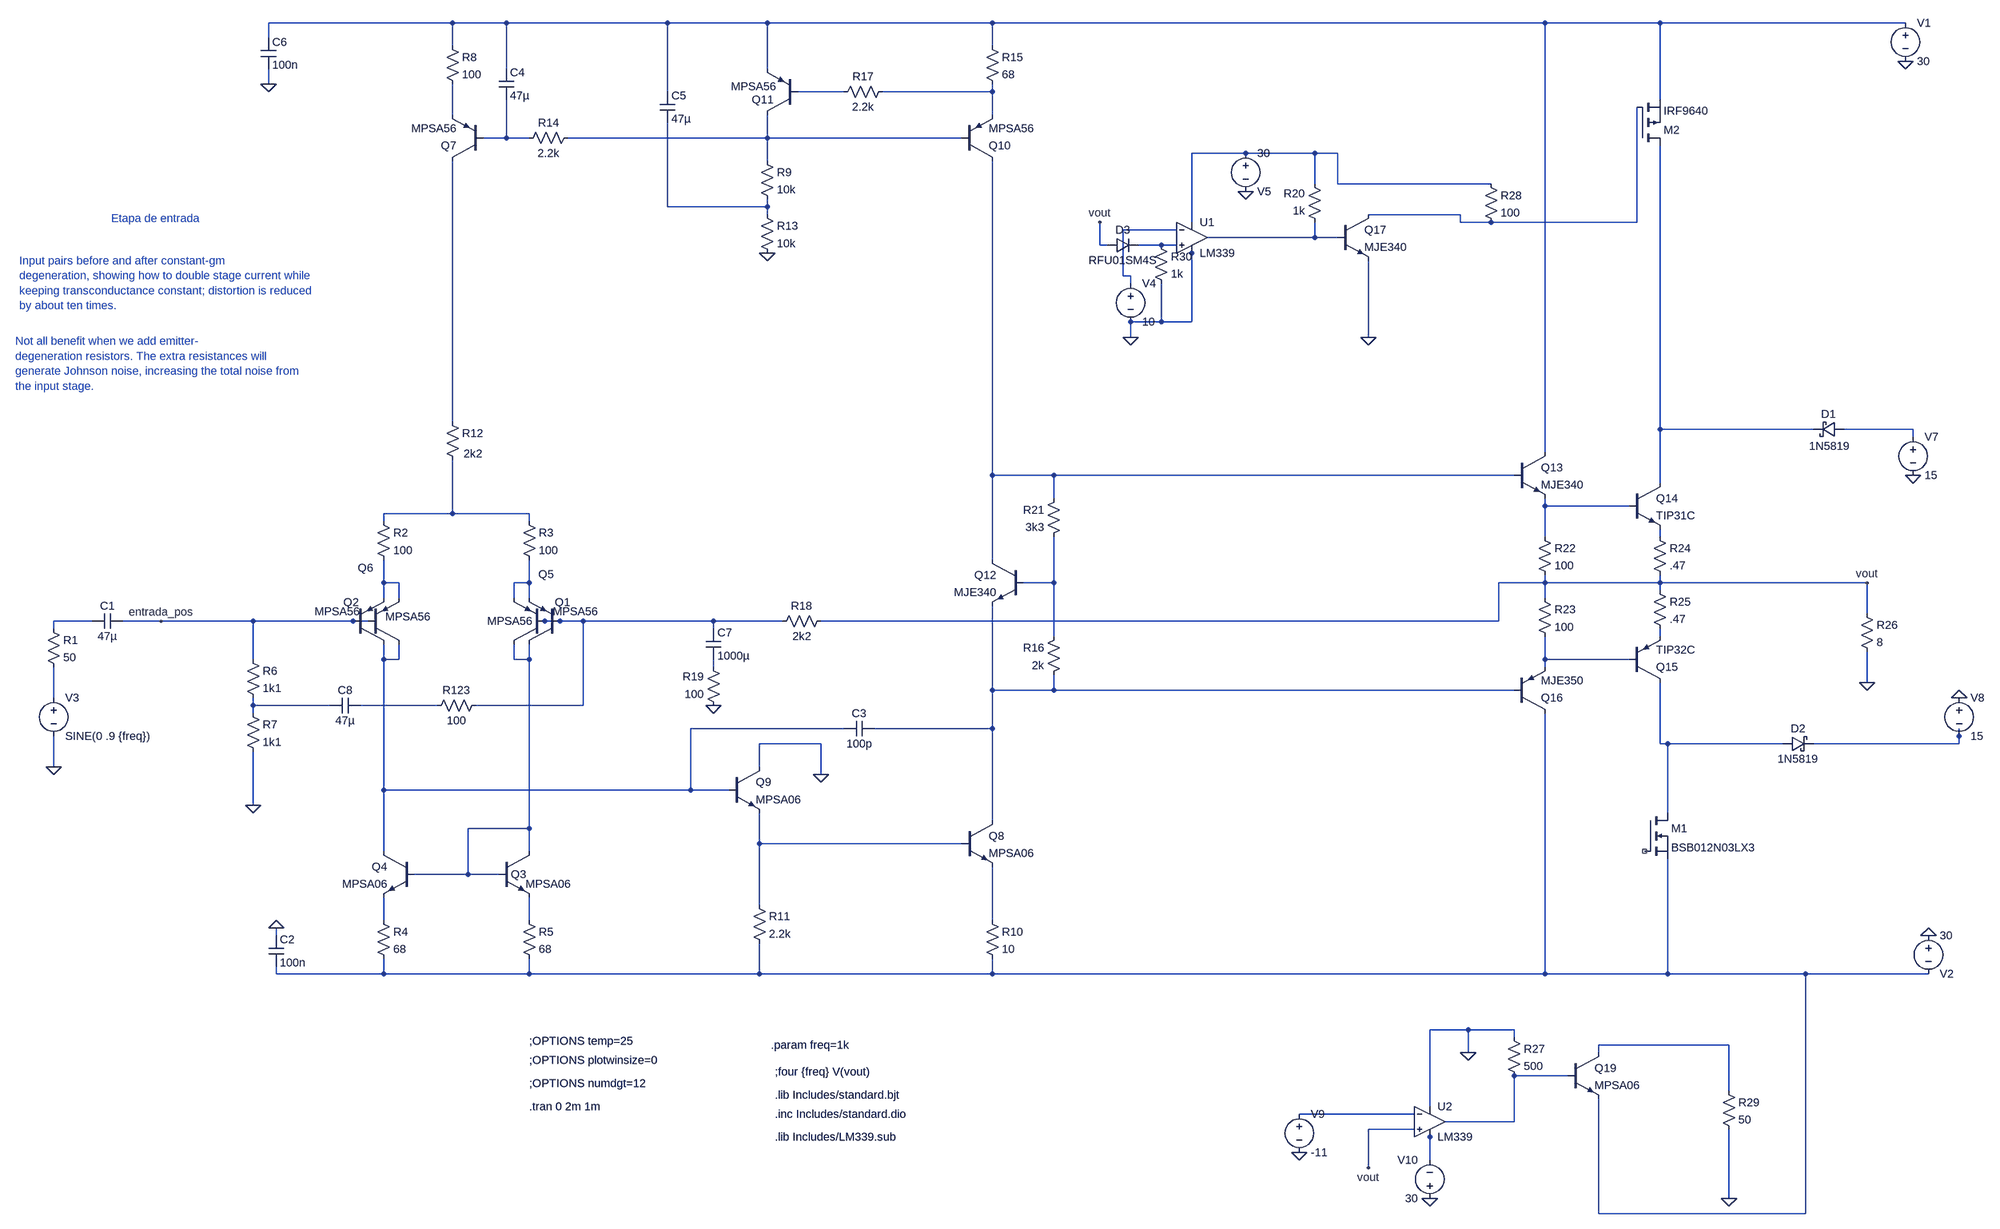
[diagram p0: schematic douglasSape.asc]
douglasSape.asc, the LTspice schematic file:
Version 4
SHEET 1 4788 1544
WIRE 480 -1824 96 -1824
WIRE 592 -1824 480 -1824
WIRE 928 -1824 592 -1824
WIRE 1136 -1824 928 -1824
WIRE 1664 -1824 1136 -1824
WIRE 2816 -1824 1664 -1824
WIRE 3056 -1824 2816 -1824
WIRE 3568 -1824 3056 -1824
WIRE 96 -1792 96 -1824
WIRE 480 -1776 480 -1824
WIRE 1664 -1776 1664 -1824
WIRE 592 -1728 592 -1824
WIRE 1136 -1728 1136 -1824
WIRE 96 -1696 96 -1728
WIRE 928 -1680 928 -1824
WIRE 1296 -1680 1200 -1680
WIRE 1664 -1680 1664 -1696
WIRE 1664 -1680 1376 -1680
WIRE 3056 -1664 3056 -1824
WIRE 480 -1632 480 -1696
WIRE 1664 -1632 1664 -1680
WIRE 592 -1584 592 -1664
WIRE 592 -1584 544 -1584
WIRE 640 -1584 592 -1584
WIRE 1136 -1584 1136 -1632
WIRE 1136 -1584 720 -1584
WIRE 1600 -1584 1136 -1584
WIRE 2192 -1552 2080 -1552
WIRE 2336 -1552 2192 -1552
WIRE 2384 -1552 2336 -1552
WIRE 1136 -1536 1136 -1584
WIRE 2336 -1488 2336 -1552
WIRE 2384 -1488 2384 -1552
WIRE 2704 -1488 2384 -1488
WIRE 928 -1440 928 -1616
WIRE 1136 -1440 1136 -1456
WIRE 1136 -1440 928 -1440
WIRE 1136 -1424 1136 -1440
WIRE 2640 -1424 2448 -1424
WIRE 2080 -1408 2080 -1552
WIRE 2640 -1408 2640 -1424
WIRE 2704 -1408 2640 -1408
WIRE 3008 -1408 3008 -1648
WIRE 3008 -1408 2704 -1408
WIRE 2048 -1392 1936 -1392
WIRE 2336 -1376 2336 -1408
WIRE 2336 -1376 2112 -1376
WIRE 2384 -1376 2336 -1376
WIRE 1888 -1360 1888 -1408
WIRE 1904 -1360 1888 -1360
WIRE 2016 -1360 1968 -1360
WIRE 2048 -1360 2016 -1360
WIRE 2080 -1344 2080 -1360
WIRE 1936 -1296 1936 -1392
WIRE 1952 -1296 1936 -1296
WIRE 1952 -1280 1952 -1296
WIRE 2016 -1200 2016 -1280
WIRE 2016 -1200 1952 -1200
WIRE 2080 -1200 2080 -1344
WIRE 2080 -1200 2016 -1200
WIRE 1952 -1168 1952 -1200
WIRE 2448 -1168 2448 -1328
WIRE 480 -992 480 -1536
WIRE 3056 -976 3056 -1568
WIRE 3376 -976 3056 -976
WIRE 3584 -976 3440 -976
WIRE 3584 -960 3584 -976
WIRE 2816 -928 2816 -1824
WIRE 1664 -880 1664 -1536
WIRE 1792 -880 1664 -880
WIRE 2752 -880 1792 -880
WIRE 3056 -864 3056 -976
WIRE 1792 -832 1792 -880
WIRE 2816 -816 2816 -832
WIRE 2992 -816 2816 -816
WIRE 480 -800 480 -912
WIRE 480 -800 336 -800
WIRE 640 -800 480 -800
WIRE 336 -784 336 -800
WIRE 640 -784 640 -800
WIRE 2816 -752 2816 -816
WIRE 3056 -752 3056 -768
WIRE 1664 -704 1664 -880
WIRE 336 -656 336 -704
WIRE 368 -656 336 -656
WIRE 640 -656 640 -704
WIRE 640 -656 608 -656
WIRE 1792 -656 1792 -752
WIRE 1792 -656 1728 -656
WIRE 2816 -656 2816 -672
WIRE 2816 -656 2720 -656
WIRE 3056 -656 3056 -672
WIRE 3056 -656 2816 -656
WIRE 3488 -656 3056 -656
WIRE 3056 -640 3056 -656
WIRE 336 -624 336 -656
WIRE 368 -624 368 -656
WIRE 608 -624 608 -656
WIRE 640 -624 640 -656
WIRE 2816 -624 2816 -656
WIRE 3488 -592 3488 -656
WIRE -272 -576 -352 -576
WIRE -128 -576 -208 -576
WIRE 64 -576 -128 -576
WIRE 272 -576 64 -576
WIRE 304 -576 272 -576
WIRE 672 -576 656 -576
WIRE 704 -576 672 -576
WIRE 752 -576 704 -576
WIRE 1024 -576 752 -576
WIRE 1168 -576 1024 -576
WIRE 2720 -576 2720 -656
WIRE 2720 -576 1248 -576
WIRE -352 -560 -352 -576
WIRE 1024 -560 1024 -576
WIRE 1792 -544 1792 -656
WIRE 3056 -544 3056 -560
WIRE 64 -496 64 -576
WIRE 336 -496 336 -528
WIRE 368 -496 368 -528
WIRE 368 -496 336 -496
WIRE 608 -496 608 -528
WIRE 640 -496 640 -528
WIRE 640 -496 608 -496
WIRE 2816 -496 2816 -544
WIRE 2992 -496 2816 -496
WIRE 1024 -480 1024 -496
WIRE 2816 -480 2816 -496
WIRE 3488 -448 3488 -512
WIRE 1664 -432 1664 -608
WIRE 1792 -432 1792 -464
WIRE 1792 -432 1664 -432
WIRE 2752 -432 1792 -432
WIRE -352 -416 -352 -480
WIRE 64 -400 64 -416
WIRE 224 -400 64 -400
WIRE 448 -400 288 -400
WIRE 752 -400 752 -576
WIRE 752 -400 528 -400
WIRE 64 -384 64 -400
WIRE 1296 -352 976 -352
WIRE 1664 -352 1664 -432
WIRE 1664 -352 1360 -352
WIRE 3680 -336 3680 -352
WIRE 1248 -320 1120 -320
WIRE 3056 -320 3056 -448
WIRE 3072 -320 3056 -320
WIRE 3312 -320 3072 -320
WIRE 3680 -320 3680 -336
WIRE 3680 -320 3376 -320
WIRE -352 -272 -352 -336
WIRE 1120 -272 1120 -320
WIRE 1248 -256 1248 -320
WIRE 336 -224 336 -496
WIRE 976 -224 976 -352
WIRE 976 -224 336 -224
WIRE 1056 -224 976 -224
WIRE 64 -192 64 -304
WIRE 3072 -176 3072 -320
WIRE 1664 -160 1664 -352
WIRE 640 -144 640 -496
WIRE 640 -144 512 -144
WIRE 1120 -112 1120 -176
WIRE 1600 -112 1120 -112
WIRE 336 -96 336 -224
WIRE 640 -96 640 -144
WIRE 512 -48 512 -144
WIRE 512 -48 400 -48
WIRE 576 -48 512 -48
WIRE 1120 16 1120 -112
WIRE 336 48 336 0
WIRE 640 48 640 0
WIRE 1664 48 1664 -64
WIRE 112 80 112 64
WIRE 112 160 112 144
WIRE 336 160 336 128
WIRE 336 160 112 160
WIRE 640 160 640 128
WIRE 640 160 336 160
WIRE 1120 160 1120 96
WIRE 1120 160 640 160
WIRE 1664 160 1664 128
WIRE 1664 160 1120 160
WIRE 2816 160 2816 -384
WIRE 2816 160 1664 160
WIRE 3072 160 3072 -80
WIRE 3072 160 2816 160
WIRE 3360 160 3072 160
WIRE 3616 160 3360 160
WIRE 2656 336 2576 336
WIRE 2752 336 2656 336
WIRE 2752 352 2752 336
WIRE 3200 368 2928 368
WIRE 2656 384 2656 336
WIRE 2928 384 2928 368
WIRE 2864 432 2752 432
WIRE 3200 464 3200 368
WIRE 2576 496 2576 336
WIRE 2544 512 2304 512
WIRE 2752 528 2752 432
WIRE 2752 528 2608 528
WIRE 2544 544 2448 544
WIRE 2576 560 2576 544
WIRE 2576 608 2576 560
WIRE 2448 624 2448 544
WIRE 3200 688 3200 544
WIRE 2928 720 2928 480
WIRE 3360 720 3360 160
WIRE 3360 720 2928 720
FLAG 64 -192 0
FLAG -352 -272 0
FLAG -128 -576 entrada_pos
FLAG 112 64 0
FLAG 1136 -1344 0
FLAG 96 -1696 0
FLAG 1248 -256 0
FLAG 3568 -1744 0
FLAG 3616 80 0
FLAG 1024 -400 0
FLAG 3488 -448 0
FLAG 3584 -880 0
FLAG 2656 384 0
FLAG 2576 688 0
FLAG 3488 -656 vout
FLAG 2448 624 vout
FLAG 1952 -1168 0
FLAG 1888 -1408 vout
FLAG 2304 592 0
FLAG 2192 -1472 0
FLAG 3680 -416 0
FLAG 3200 688 0
FLAG 2448 -1168 0
SYMBOL pnp 704 -528 R180
WINDOW 0 -21 87 Left 2
WINDOW 3 -79 68 Left 2
SYMATTR InstName Q1
SYMATTR Value MPSA56
SYMBOL pnp 272 -528 M180
WINDOW 0 -20 87 Left 2
WINDOW 3 -80 68 Left 2
SYMATTR InstName Q2
SYMATTR Value MPSA56
SYMBOL res -368 -576 R0
SYMATTR InstName R1
SYMATTR Value 50
SYMBOL cap -208 -592 R90
WINDOW 0 0 32 VBottom 2
WINDOW 3 32 32 VTop 2
SYMATTR InstName C1
SYMATTR Value 47µ
SYMBOL npn 576 -96 R0
WINDOW 0 25 48 Left 2
SYMATTR InstName Q3
SYMATTR Value MPSA06
SYMBOL npn 400 -96 M0
SYMATTR InstName Q4
SYMATTR Value MPSA06
SYMBOL res 320 -800 R0
SYMATTR InstName R2
SYMATTR Value 100
SYMBOL res 624 -800 R0
SYMATTR InstName R3
SYMATTR Value 100
SYMBOL res 320 32 R0
SYMATTR InstName R4
SYMATTR Value 68
SYMBOL res 624 32 R0
SYMATTR InstName R5
SYMATTR Value 68
SYMBOL cap 96 80 R0
SYMATTR InstName C2
SYMATTR Value 100n
SYMBOL pnp 672 -528 R180
WINDOW 0 -19 146 Left 2
WINDOW 3 25 48 Left 2
SYMATTR InstName Q5
SYMATTR Value MPSA56
SYMBOL pnp 304 -528 M180
WINDOW 0 -22 159 Left 2
WINDOW 3 36 57 Left 2
SYMATTR InstName Q6
SYMATTR Value MPSA56
SYMBOL res 464 -1792 R0
SYMATTR InstName R8
SYMATTR Value 100
SYMBOL pnp 544 -1536 R180
SYMATTR InstName Q7
SYMATTR Value MPSA56
SYMBOL res 1120 -1552 R0
SYMATTR InstName R9
SYMATTR Value 10k
SYMBOL res 464 -1008 R0
WINDOW 3 39 83 Left 2
SYMATTR Value 2k2
SYMATTR InstName R12
SYMBOL cap 576 -1728 R0
SYMATTR InstName C4
SYMATTR Value 47µ
SYMBOL res 1120 -1440 R0
SYMATTR InstName R13
SYMATTR Value 10k
SYMBOL cap 912 -1680 R0
SYMATTR InstName C5
SYMATTR Value 47µ
SYMBOL cap 80 -1792 R0
SYMATTR InstName C6
SYMATTR Value 100n
SYMBOL res 736 -1600 R90
WINDOW 0 0 56 VBottom 2
WINDOW 3 32 56 VTop 2
SYMATTR InstName R14
SYMATTR Value 2.2k
SYMBOL res 1648 32 R0
SYMATTR InstName R10
SYMATTR Value 10
SYMBOL npn 1600 -160 R0
SYMATTR InstName Q8
SYMATTR Value MPSA06
SYMBOL npn 1056 -272 R0
SYMATTR InstName Q9
SYMATTR Value MPSA06
SYMBOL res 1104 0 R0
SYMATTR InstName R11
SYMATTR Value 2.2k
SYMBOL res 1648 -1792 R0
SYMATTR InstName R15
SYMATTR Value 68
SYMBOL pnp 1600 -1536 M180
SYMATTR InstName Q10
SYMATTR Value MPSA56
SYMBOL pnp 1200 -1632 R180
WINDOW 0 50 32 Left 2
WINDOW 3 45 59 Left 2
SYMATTR InstName Q11
SYMATTR Value MPSA56
SYMBOL res 1392 -1696 R90
WINDOW 0 0 56 VBottom 2
WINDOW 3 32 56 VTop 2
SYMATTR InstName R17
SYMATTR Value 2.2k
SYMBOL voltage 3568 -1840 R0
WINDOW 123 0 0 Left 0
WINDOW 39 0 0 Left 0
SYMATTR InstName V1
SYMATTR Value 30
SYMBOL voltage 3616 64 R0
WINDOW 0 24 96 Left 2
WINDOW 3 24 16 Left 2
WINDOW 123 0 0 Left 0
WINDOW 39 0 0 Left 0
SYMATTR InstName V2
SYMATTR Value 30
SYMBOL res 1264 -592 R90
WINDOW 0 0 56 VBottom 2
WINDOW 3 32 56 VTop 2
SYMATTR InstName R18
SYMATTR Value 2k2
SYMBOL res 1040 -384 R180
WINDOW 0 36 76 Left 2
WINDOW 3 36 40 Left 2
SYMATTR InstName R19
SYMATTR Value 100
SYMBOL cap 1008 -560 R0
SYMATTR InstName C7
SYMATTR Value 1000µ
SYMBOL voltage -352 -432 R0
WINDOW 123 0 0 Left 0
WINDOW 39 0 0 Left 0
SYMATTR InstName V3
SYMATTR Value SINE(0 .9 {freq})
SYMBOL cap 1360 -368 R90
WINDOW 0 0 32 VBottom 2
WINDOW 3 32 32 VTop 2
SYMATTR InstName C3
SYMATTR Value 100p
SYMBOL res 48 -512 R0
SYMATTR InstName R6
SYMATTR Value 1k1
SYMBOL res 48 -400 R0
SYMATTR InstName R7
SYMATTR Value 1k1
SYMBOL cap 288 -416 R90
WINDOW 0 0 32 VBottom 2
WINDOW 3 32 32 VTop 2
SYMATTR InstName C8
SYMATTR Value 47µ
SYMBOL res 544 -416 R90
WINDOW 0 0 56 VBottom 2
WINDOW 3 32 56 VTop 2
SYMATTR InstName R123
SYMATTR Value 100
SYMBOL npn 1728 -704 M0
SYMATTR InstName Q12
SYMATTR Value MJE340
SYMBOL res 1808 -560 M0
SYMATTR InstName R16
SYMATTR Value 2k
SYMBOL res 1808 -848 M0
SYMATTR InstName R21
SYMATTR Value 3k3
SYMBOL npn 2752 -928 R0
SYMATTR InstName Q13
SYMATTR Value MJE340
SYMBOL npn 2992 -864 R0
SYMATTR InstName Q14
SYMATTR Value TIP31C
SYMBOL pnp 2992 -448 M180
SYMATTR InstName Q15
SYMATTR Value TIP32C
SYMBOL pnp 2752 -384 M180
SYMATTR InstName Q16
SYMATTR Value MJE350
SYMBOL res 2800 -768 R0
SYMATTR InstName R22
SYMATTR Value 100
SYMBOL res 2800 -640 R0
SYMATTR InstName R23
SYMATTR Value 100
SYMBOL res 3040 -768 R0
SYMATTR InstName R24
SYMATTR Value .47
SYMBOL res 3040 -656 R0
SYMATTR InstName R25
SYMATTR Value .47
SYMBOL res 3472 -608 R0
SYMATTR InstName R26
SYMATTR Value 8
SYMBOL voltage 3584 -976 R0
WINDOW 123 0 0 Left 0
WINDOW 39 0 0 Left 0
SYMATTR InstName V7
SYMATTR Value 15
SYMBOL voltage 3680 -432 R0
WINDOW 123 0 0 Left 0
WINDOW 39 0 0 Left 0
SYMATTR InstName V8
SYMATTR Value 15
SYMBOL schottky 3440 -992 R90
WINDOW 0 0 32 VBottom 2
WINDOW 3 35 30 VTop 2
SYMATTR InstName D1
SYMATTR Value 1N5819
SYMATTR Description Diode
SYMATTR Type diode
SYMBOL Opamps\\opamp2 2576 464 R0
SYMATTR InstName U2
SYMATTR Value LM339
SYMBOL voltage 2304 496 R0
WINDOW 123 0 0 Left 0
WINDOW 39 0 0 Left 0
SYMATTR InstName V9
SYMATTR Value -11
SYMBOL res 2736 336 R0
SYMATTR InstName R27
SYMATTR Value 500
SYMBOL voltage 2576 704 R180
WINDOW 0 24 96 Left 2
WINDOW 3 24 16 Left 2
WINDOW 123 0 0 Left 0
WINDOW 39 0 0 Left 0
SYMATTR InstName V10
SYMATTR Value 30
SYMBOL npn 2864 384 R0
SYMATTR InstName Q19
SYMATTR Value MPSA06
SYMBOL Opamps\\opamp2 2080 -1440 R0
SYMATTR InstName U1
SYMATTR Value LM339
SYMBOL voltage 1952 -1296 R0
WINDOW 123 0 0 Left 0
WINDOW 39 0 0 Left 0
SYMATTR InstName V4
SYMATTR Value 10
SYMBOL schottky 3312 -304 R270
WINDOW 0 32 32 VTop 2
WINDOW 3 0 32 VBottom 2
SYMATTR InstName D2
SYMATTR Value 1N5819
SYMATTR Description Diode
SYMATTR Type diode
SYMBOL res 2352 -1392 R180
WINDOW 0 36 76 Left 2
WINDOW 3 36 40 Left 2
SYMATTR InstName R20
SYMATTR Value 1k
SYMBOL npn 2384 -1424 R0
SYMATTR InstName Q17
SYMATTR Value MJE340
SYMBOL voltage 2192 -1568 R0
WINDOW 0 24 96 Left 2
WINDOW 3 24 16 Left 2
WINDOW 123 0 0 Left 0
WINDOW 39 0 0 Left 0
SYMATTR InstName V5
SYMATTR Value 30
SYMBOL res 3184 448 R0
SYMATTR InstName R29
SYMATTR Value 50
SYMBOL nmos 3024 -176 R0
SYMATTR InstName M1
SYMATTR Value BSB012N03LX3
SYMBOL pmos 3008 -1568 M180
SYMATTR InstName M2
SYMATTR Value IRF9640
SYMBOL res 2688 -1504 R0
SYMATTR InstName R28
SYMATTR Value 100
SYMBOL diode 1904 -1344 R270
WINDOW 0 32 32 VTop 2
WINDOW 3 0 32 VBottom 2
SYMATTR InstName D3
SYMATTR Value RFU01SM4S
SYMBOL res 2000 -1376 R0
SYMATTR InstName R30
SYMATTR Value 1k
TEXT 1152 472 Left 2 !.lib Includes/standard.bjt
TEXT 640 496 Left 2 !.tran 0 2m 1m
TEXT 1152 512 Left 2 !.inc Includes/standard.dio
TEXT 1152 424 Left 2 !;four {freq} V(vout)
TEXT 1144 368 Left 2 !.param freq=1k
TEXT -424 -1328 Left 2 ;Input pairs before and after constant-gm\ndegeneration, showing how to double stage current while\nkeeping transconductance constant; distortion is reduced\nby about ten times.
TEXT -432 -1160 Left 2 ;Not all benefit when we add emitter-\ndegeneration resistors. The extra resistances will\ngenerate Johnson noise, increasing the total noise from\nthe input stage.
TEXT -232 -1416 Left 2 ;Etapa de entrada
TEXT 640 400 Left 2 !;OPTIONS plotwinsize=0
TEXT 640 448 Left 2 !;OPTIONS numdgt=12
TEXT 640 360 Left 2 !;OPTIONS temp=25
TEXT 1152 560 Left 2 !.lib Includes/LM339.sub

The netlist it stands for:
* douglasSape.asc
Q1 N027 N024 N021 0 MPSA56
Q2 N026 entrada_pos N020 0 MPSA56
R1 N023 N031 50
C1 entrada_pos N023 47µ
Q3 N027 N027 N038 0 MPSA06
Q4 N026 N027 N037 0 MPSA06
R2 N018 N020 100
R3 N018 N021 100
R4 N037 N040 68
R5 N038 N040 68
C2 0 N040 100n
Q5 N027 N024 N021 0 MPSA56
Q6 N026 entrada_pos N020 0 MPSA56
R8 N001 N004 100
Q7 N013 N005 N004 0 MPSA56
R9 N006 N008 10k
R12 N013 N018 2k2
C4 N001 N005 47µ
R13 N008 0 10k
C5 N001 N008 47µ
C6 N001 0 100n
R14 N006 N005 2.2k
R10 N039 N040 10
Q8 N030 N036 N039 0 MPSA06
Q9 0 N026 N036 0 MPSA06
R11 N036 N040 2.2k
R15 N001 N003 68
Q10 N016 N006 N003 0 MPSA56
Q11 N006 N002 N001 0 MPSA56
R17 N003 N002 2.2k
V1 N001 0 30
V2 0 N040 30
R18 vout N024 2k2
R19 0 N029 100
C7 N024 N029 1000µ
V3 N031 0 SINE(0 .9 {freq})
C3 N030 N026 100p
R6 entrada_pos N032 1k1
R7 N032 0 1k1
C8 N033 N032 47µ
R123 N024 N033 100
Q12 N016 N022 N030 0 MJE340
R16 N022 N030 2k
R21 N016 N022 3k3
Q13 N001 N016 N017 0 MJE340
Q14 N014 N017 N019 0 TIP31C
Q15 N035 N028 N025 0 TIP32C
Q16 N040 N030 N028 0 MJE350
R22 N017 vout 100
R23 vout N028 100
R24 N019 vout .47
R25 vout N025 .47
R26 vout 0 8
V7 N015 0 15
V8 0 N034 15
D1 N015 N014 1N5819
XU2 vout N043 0 N044 N042 LM339  ; pins In+ In- V+ V- OUT
V9 N043 0 -11
R27 0 N042 500
V10 0 N044 30
Q19 N041 N042 N040 0 MPSA06
XU1 N012 N010 N007 0 N011 LM339  ; pins In+ In- V+ V- OUT
V4 N010 0 10
D2 N035 N034 1N5819
R20 N011 N007 1k
Q17 N009 N011 0 0 MJE340
V5 N007 0 30
R29 N041 0 50
M1 N035 NC_01 N040 N040 BSB012N03LX3
M2 N014 N009 N001 N001 IRF9640
R28 N007 N009 100
D3 vout N012 RFU01SM4S
R30 N012 0 1k
.model D D
.lib standard.dio
.model NPN NPN
.model PNP PNP
.lib standard.bjt
.model NMOS NMOS
.model PMOS PMOS
.lib standard.mos
.lib Includes/standard.bjt
.tran 0 2m 1m
.inc Includes/standard.dio
;four {freq} V(vout)
.param freq=1k
* Input pairs before and after constant-gm
* degeneration, showing how to double stage current while
* keeping transconductance constant; distortion is reduced
* by about ten times.
* Not all benefit when we add emitter-
* degeneration resistors. The extra resistances will
* generate Johnson noise, increasing the total noise from
* the input stage.
* Etapa de entrada
;OPTIONS plotwinsize=0
;OPTIONS numdgt=12
;OPTIONS temp=25
.lib Includes/LM339.sub
.backanno
.end